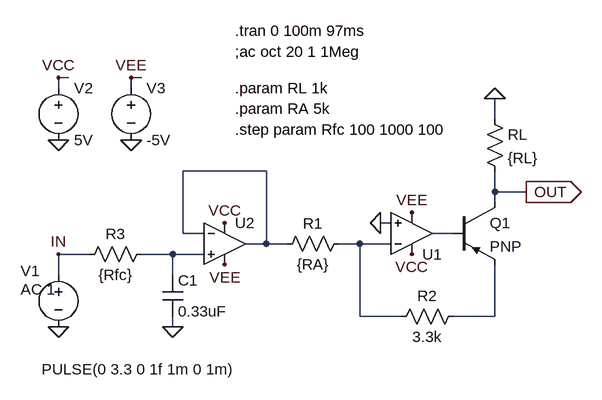
[diagram p0: schematic V-I Convert wLPF Amp3.asc]
V-I Convert wLPF Amp3.asc, the LTspice schematic file:
Version 4
SHEET 1 1132 680
WIRE -16 -80 -32 -80
WIRE 96 -80 80 -80
WIRE -32 -64 -32 -80
WIRE 80 -64 80 -80
WIRE 640 -16 640 -48
WIRE 288 64 160 64
WIRE 640 96 640 64
WIRE 688 96 640 96
WIRE 640 112 640 96
WIRE 480 144 464 144
WIRE 160 160 160 64
WIRE 192 160 160 160
WIRE 576 160 544 160
WIRE 288 176 288 64
WIRE 288 176 256 176
WIRE 320 176 288 176
WIRE 432 176 400 176
WIRE 480 176 432 176
WIRE 16 192 -32 192
WIRE 144 192 96 192
WIRE 192 192 144 192
WIRE -32 224 -32 192
WIRE 144 224 144 192
WIRE 432 288 432 176
WIRE 496 288 432 288
WIRE 640 288 640 208
WIRE 640 288 576 288
WIRE 144 304 144 288
FLAG 464 144 0
FLAG 640 -48 0
FLAG 512 192 VCC
FLAG 512 128 VEE
FLAG -32 304 0
FLAG -32 16 0
FLAG -32 -80 VCC
FLAG 80 16 0
FLAG 80 -80 VEE
FLAG -32 192 IN
FLAG 688 96 OUT
IOPIN 688 96 Out
FLAG 144 304 0
FLAG 224 144 VCC
FLAG 224 208 VEE
SYMBOL Opamps\\UniversalOpamp2 512 160 M180
SYMATTR InstName U1
SYMBOL res 416 160 R90
WINDOW 0 0 56 VBottom 2
WINDOW 3 32 56 VTop 2
SYMATTR InstName R1
SYMATTR Value {RA}
SYMBOL res 592 272 R90
WINDOW 0 0 56 VBottom 2
WINDOW 3 32 56 VTop 2
SYMATTR InstName R2
SYMATTR Value 3.3k
SYMBOL pnp 576 112 R0
SYMATTR InstName Q1
SYMBOL res 624 -32 R0
SYMATTR InstName RL
SYMATTR Value {RL}
SYMBOL voltage -32 208 R0
WINDOW 3 -26 161 Left 2
WINDOW 123 -58 38 Left 2
WINDOW 39 0 0 Left 2
WINDOW 0 -58 10 Left 2
SYMATTR Value PULSE(0 3.3 0 1f 1m 0 1m)
SYMATTR Value2 AC 1
SYMATTR InstName V1
SYMBOL voltage -32 -80 R0
SYMATTR InstName V2
SYMATTR Value 5V
SYMBOL voltage 80 -80 R0
WINDOW 123 0 0 Left 2
WINDOW 39 0 0 Left 2
SYMATTR InstName V3
SYMATTR Value -5V
SYMBOL cap 128 224 R0
SYMATTR InstName C1
SYMATTR Value 0.33uF
SYMBOL res 112 176 R90
WINDOW 0 0 56 VBottom 2
WINDOW 3 32 56 VTop 2
SYMATTR InstName R3
SYMATTR Value {Rfc}
SYMBOL Opamps\\UniversalOpamp2 224 176 R0
SYMATTR InstName U2
TEXT 240 -152 Left 2 !.tran 0 100m 97ms
TEXT 240 -64 Left 2 !.param RL 1k
TEXT 240 -120 Left 2 !;ac oct 20 1 1Meg
TEXT 240 0 Left 2 !.step param Rfc 100 1000 100
TEXT 240 -32 Left 2 !.param RA 5k

The netlist it stands for:
* V-I Convert wLPF Amp3.asc
XU1 0 N003 VCC VEE N002 level.2 Avol=1Meg GBW=10Meg Slew=10Meg ilimit=25m rail=0 Vos=0 phimargin=45 en=0 enk=0 in=0 ink=0 Rin=500Meg  ; pins IN+ IN- V+ V- OUT
R1 N003 N001 {RA}
R2 N005 N003 3.3k
Q1 OUT N002 N005 0 PNP
RL 0 OUT {RL}
V1 IN 0 PULSE(0 3.3 0 1f 1m 0 1m) AC 1
V2 VCC 0 5V
V3 VEE 0 -5V
C1 N004 0 0.33uF
R3 N004 IN {Rfc}
XU2 N004 N001 VCC VEE N001 level.2 Avol=1Meg GBW=10Meg Slew=10Meg ilimit=25m rail=0 Vos=0 phimargin=45 en=0 enk=0 in=0 ink=0 Rin=500Meg  ; pins IN+ IN- V+ V- OUT
.model NPN NPN
.model PNP PNP
.lib standard.bjt
.tran 0 100m 97ms
.param RL 1k
;ac oct 20 1 1Meg
.step param Rfc 100 1000 100
.param RA 5k
.lib UniversalOpamps2.sub
.backanno
.end